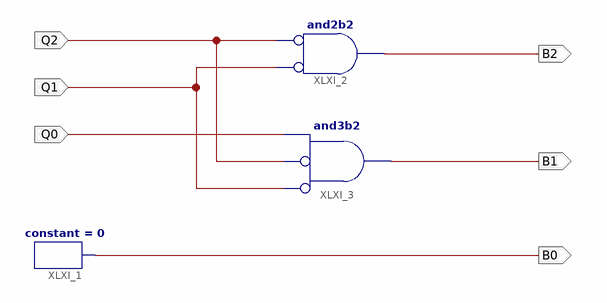
[diagram p0: schematic sheet 1]
// Xilinx ISE schematic dekoder.sch (spartan3e) as structural Verilog: 3 symbols, 6 ports
module dekoder (
  input  Q1,
  input  Q2,
  input  Q0,
  output B0,
  output B1,
  output B2
);

  constant #(.CValue("0")) XLXI_1 (.O(B0));
  and XLXI_2 (B2, ~Q1, ~Q2);  // and2b2
  and XLXI_3 (B1, ~Q1, ~Q2, Q0);  // and3b2
endmodule
